# EAGLE schematic BSPD (EAGLE 9.2.1)
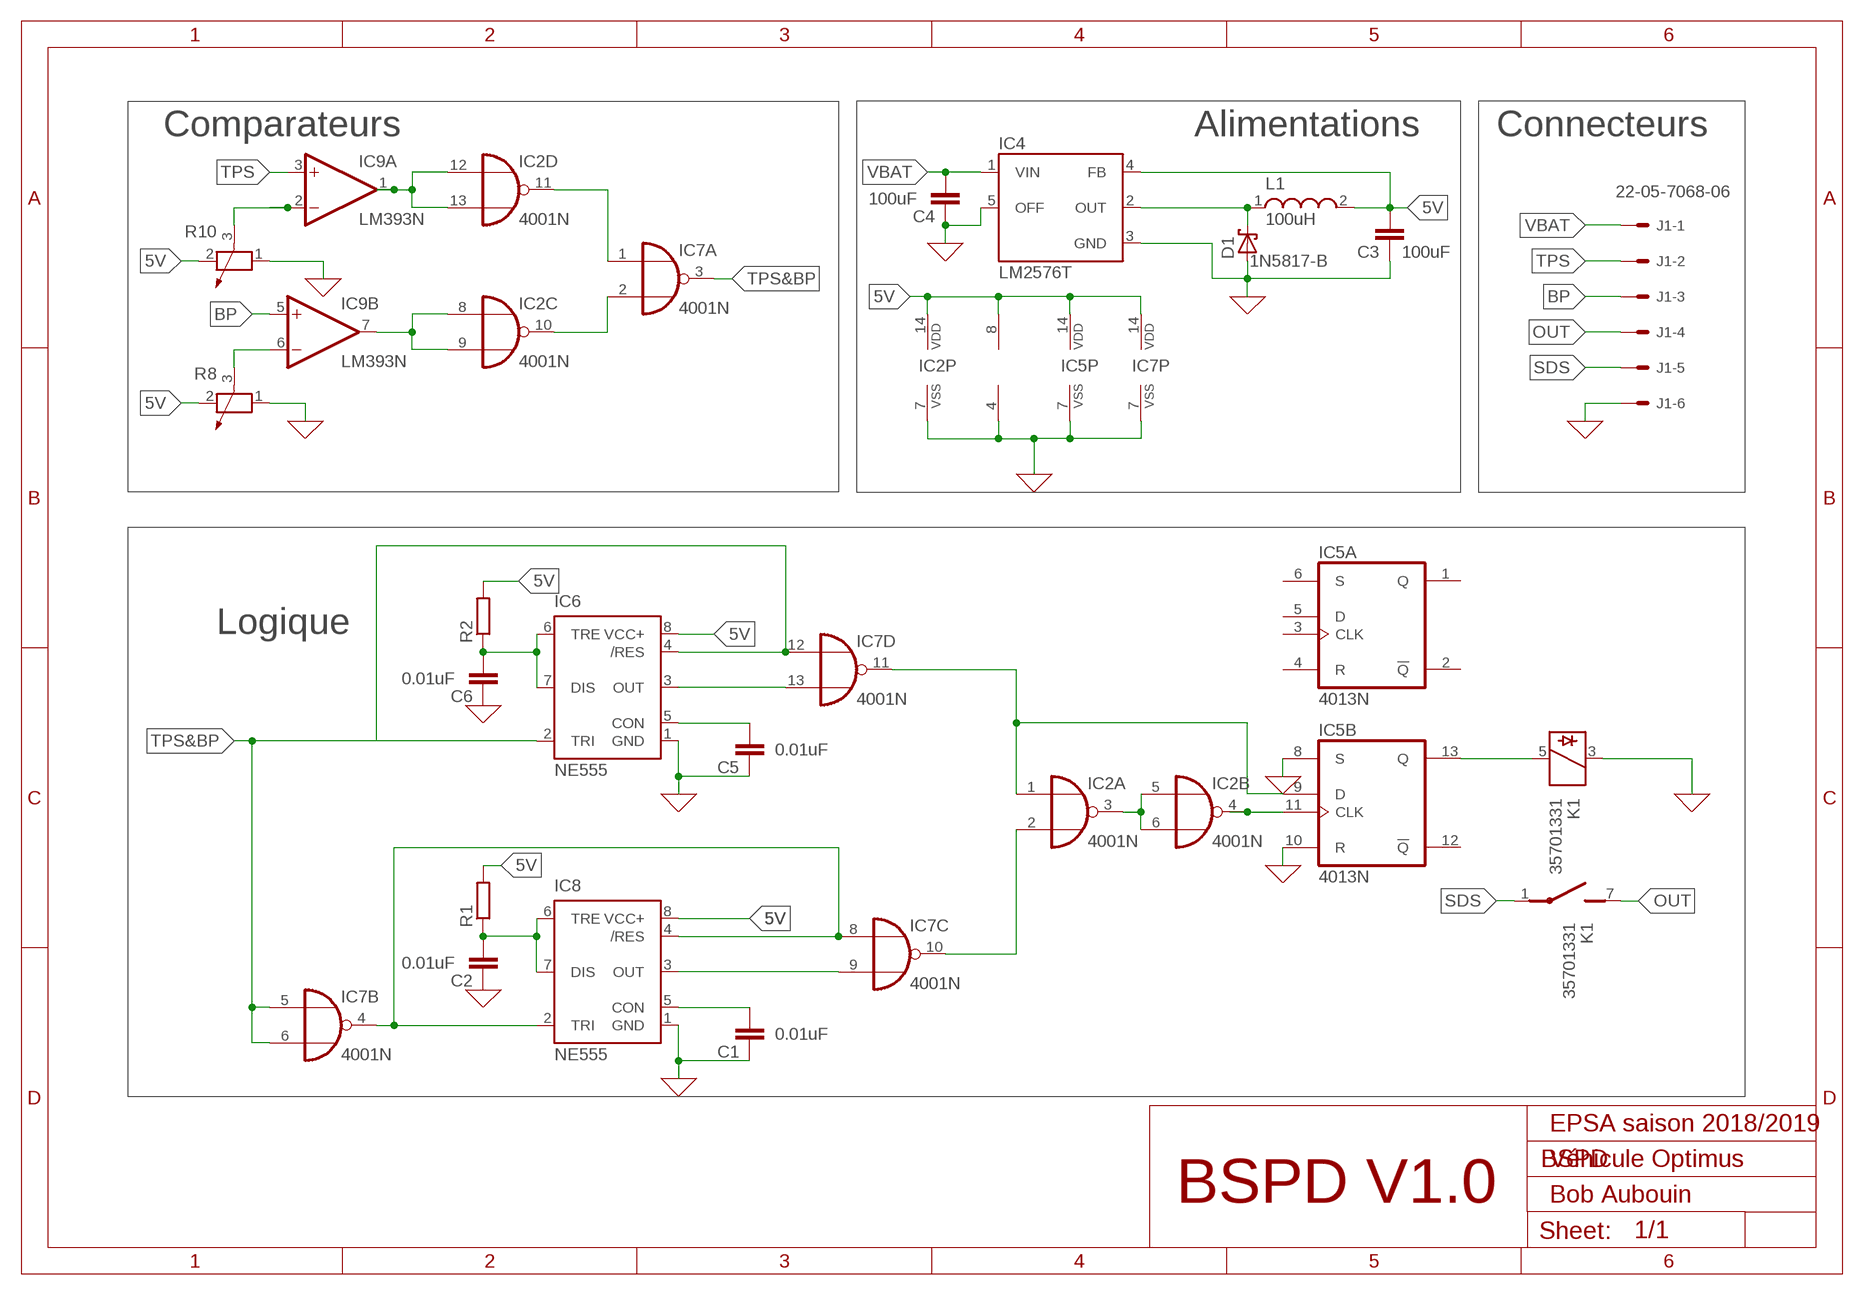
[diagram p0: schematic, sheet 1]

## Parts
C1  0.01uF  C-EU025-025X050  [C025-025X050]
C2  0.01uF  C-EU025-025X050  [C025-025X050]
C3  100uF  C-EU025-025X050  [C025-025X050]
C4  100uF  C-EU025-025X050  [C025-025X050]
C5  0.01uF  C-EU025-025X050  [C025-025X050]
C6  0.01uF  C-EU025-025X050  [C025-025X050]
D1  1N5817-B  [DO41-7.6]
IC2  4001N  [DIL14]
IC4  LM2576T  [TO220-5]
IC5  4013N  [DIL14]
IC6  NE555  [DIL-08]
IC7  4001N  [DIL14]
IC8  NE555  [DIL-08]
IC9  LM393N  [DIL08]
J1  22-05-7068-06  [7395-06]
K1  35701331  [REED]
L1  100uH  WE-TI_8012  [WE-TI_8012]
R1  R-EU_0207/10  [0207/10]
R2  R-EU_0207/10  [0207/10]
R8  POTENTIOMETER_PT_SPIN  [PT-SPIN]
R10  POTENTIOMETER_PT_SPIN  [PT-SPIN]

## Nets
0: C1.1 C2.1 C3.1 C4.1 C5.1 C6.1 D1.A IC2.7(P:VSS) IC4.3(GND) IC4.5(OFF) IC5.7(P:VSS) IC5.8(B:S) IC5.10(B:R) IC6.1(GND) IC7.7(P:VSS) IC8.1(GND) IC9.4(P:V-) J1.6 K1.3 R8.1 R10.1 ; supply symbol labelled GND
5V: C3.2 IC2.14(P:VDD) IC4.4(FB) IC5.14(P:VDD) IC6.8(VCC+) IC7.14(P:VDD) IC8.8(VCC+) IC9.8(P:V+) L1.2 R1.2 R2.2 R8.2 R10.2
BP: IC9.5(B:+IN) J1.3
N$1: C1.2 IC8.5(CON)
N$2: IC7.4(B:O) IC7.8(C:I0) IC8.2(TRI) IC8.4(/RES)
N$3: C2.2 IC8.6(TRE) IC8.7(DIS) R1.1
N$4: IC7.9(C:I1) IC8.3(OUT)
N$5: C6.2 IC6.6(TRE) IC6.7(DIS) R2.1
N$6: C5.2 IC6.5(CON)
N$7: IC2.12(D:I0) IC2.13(D:I1) IC9.1(A:OUT)
N$8: IC2.2(A:I1) IC7.10(C:O)
N$9: IC2.1(A:I0) IC5.9(B:D) IC7.11(D:O)
N$10: IC2.4(B:O) IC5.11(B:CLK)
N$11: IC6.3(OUT) IC7.13(D:I1)
N$12: IC5.13(B:Q) K1.5
N$13: IC9.2(A:-IN) R10.3
N$14: IC9.6(B:-IN) R8.3
N$15: IC2.8(C:I0) IC2.9(C:I1) IC9.7(B:OUT)
N$16: D1.C IC4.2(OUT) L1.1
N$17: IC2.11(D:O) IC7.1(A:I0)
N$18: IC2.10(C:O) IC7.2(A:I1)
N$19: IC2.3(A:O) IC2.5(B:I0) IC2.6(B:I1)
OUT: J1.4 K1.7(2:S)
SDS: J1.5 K1.1(2:P)
TPS: IC9.3(A:+IN) J1.2
TPS&BP: IC6.2(TRI) IC6.4(/RES) IC7.3(A:O) IC7.5(B:I0) IC7.6(B:I1) IC7.12(D:I0)
VBAT: C4.2 IC4.1(VIN) J1.1
Unconnected: IC5.1(A:Q) IC5.2(A:!Q) IC5.3(A:CLK) IC5.4(A:R) IC5.5(A:D) IC5.6(A:S) IC5.12(B:!Q)

## Notes on the sheet
- Comparateurs | Alimentations | Connecteurs
- Logique
- EPSA saison 2018/2019
- Véhicule Optimus
- BSPD V1.0 | Bob Aubouin

## Library data of the parts
C1-C6 = rcl:C-EU: CAPACITOR, European symbol; SPICEPREFIX: C
D1 = diode:1N581*: 1.0A SCHOTTKY BARRIER RECTIFIER Source: http://www.diodes.com/datasheets/ds23001.pdf
IC2 IC7 = 40xx:4001: Quad 2-input NOR
IC4 = v-reg-3:LM2576: National Semiconductor <http://www.national.com> 3.0A "Simple Switcher"(c) 52kHz, Vout 1.23-37V (HV: 57V), Vin 40V (HV: 60V), 50µA standby current
IC5 = 40xx:4013: Dual D FLIP FLOP, set/reset
IC6 IC8 = st-microelectronics:NE555: General purpose bipolar Timer; MF: Arrow Electronics; MPN: NE555N; OC_FARNELL: 1467742; OC_NEWARK: 89K1486
IC9 = linear:LM393: COMPARATOR
J1 = con-molex:22-?-06: CONNECTOR wire to board 2.54 mm (.1 inch) pitch header; MF: MOLEX; OC_FARNELL: unknown; OC_NEWARK: unknown
K1 = relay:35701331: RELAY reed, 1 x norm. open with polarity; OC_FARNELL: unknown; OC_NEWARK: unknown
L1 = wurth_elektronik_passive_rev16d:WE-TI: Radial Leaded Wire Wound Inductor Characteristics Radial through-hole inductor High saturation core material Small size Maximum current up to 8.5 A Custom design on request Applications Signal filtering Switches, switching power supply for small and medium voltage Power supply filter EMI filter <http://katalog.we-online.de/media/images/eisos/IndTI_pf2.jpg> Details see: http://katalog.we-online.de/en/pbs/WE-TI? Updated by Dan Xu 2014-07-11 2014 (C) Wurth Elektronik
R1 R2 = rcl:R-EU_: RESISTOR, European symbol; SPICEPREFIX: R
R8 R10 = rcl:POTENTIOMETER_: Potentiometer; SPICEMODEL: POT; SPICEPREFIX: X